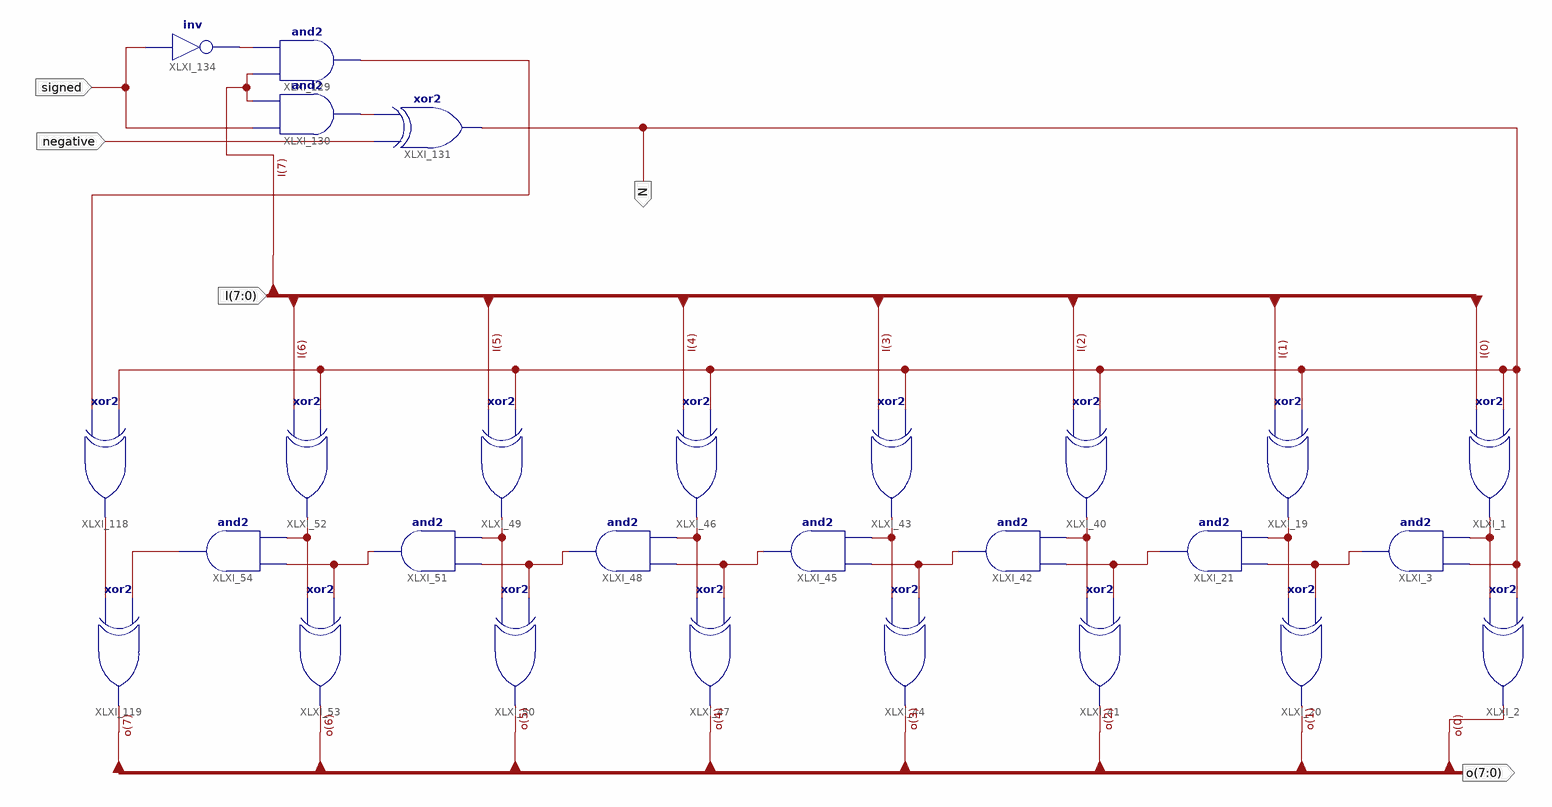
[diagram p0: schematic sheet 1]
// Xilinx ISE schematic twoComplement.sch (spartan3e) as structural Verilog: 27 symbols, 5 ports
module twoComplement (
  input  [7:0] I,
  input  negative,
  input  \signed ,
  output [7:0] o,
  output N
);

  wire XLXN_1, XLXN_13, XLXN_27, XLXN_29, XLXN_31, XLXN_33, XLXN_35, XLXN_79, XLXN_89, XLXN_90, XLXN_91,
       XLXN_92, XLXN_93, XLXN_94, XLXN_95, XLXN_118, XLXN_123, XLXN_124;

  xor XLXI_1 (XLXN_1, I[0], N);
  xor XLXI_2 (o[0], XLXN_1, N);
  and XLXI_3 (XLXN_89, XLXN_1, N);
  xor XLXI_19 (XLXN_13, I[1], N);
  xor XLXI_20 (o[1], XLXN_13, XLXN_89);
  and XLXI_21 (XLXN_90, XLXN_13, XLXN_89);
  xor XLXI_40 (XLXN_27, I[2], N);
  xor XLXI_41 (o[2], XLXN_27, XLXN_90);
  and XLXI_42 (XLXN_91, XLXN_27, XLXN_90);
  xor XLXI_43 (XLXN_29, I[3], N);
  xor XLXI_44 (o[3], XLXN_29, XLXN_91);
  and XLXI_45 (XLXN_92, XLXN_29, XLXN_91);
  xor XLXI_46 (XLXN_31, I[4], N);
  xor XLXI_47 (o[4], XLXN_31, XLXN_92);
  and XLXI_48 (XLXN_93, XLXN_31, XLXN_92);
  xor XLXI_49 (XLXN_33, I[5], N);
  xor XLXI_50 (o[5], XLXN_33, XLXN_93);
  and XLXI_51 (XLXN_94, XLXN_33, XLXN_93);
  xor XLXI_52 (XLXN_35, I[6], N);
  xor XLXI_53 (o[6], XLXN_35, XLXN_94);
  and XLXI_54 (XLXN_95, XLXN_35, XLXN_94);
  xor XLXI_118 (XLXN_79, XLXN_123, N);
  xor XLXI_119 (o[7], XLXN_79, XLXN_95);
  and XLXI_129 (XLXN_123, I[7], XLXN_124);
  and XLXI_130 (XLXN_118, \signed , I[7]);
  xor XLXI_131 (N, negative, XLXN_118);
  not XLXI_134 (XLXN_124, \signed );
endmodule
